# EAGLE design BSK4 (EAGLE 9.4.2)
ESKD_DESCRIPTION1: 207|235|224|242|224|32|193|209|202|52; ESKD_DESCRIPTION2: 241|245|229|236|224|32|253|235|229|234|242|240|232|247|229|241|234|224|255; ESKD_DESCRIPTION3: 239|240|232|237|246|232|239|232|224|235|252|237|224|255; ESKD_NUMBER: 67|67|83|50|46|50|53|48|48|45|48|221|51; ESKD_NUMBER_SHEET: 49; ESKD_SHEETS: 49
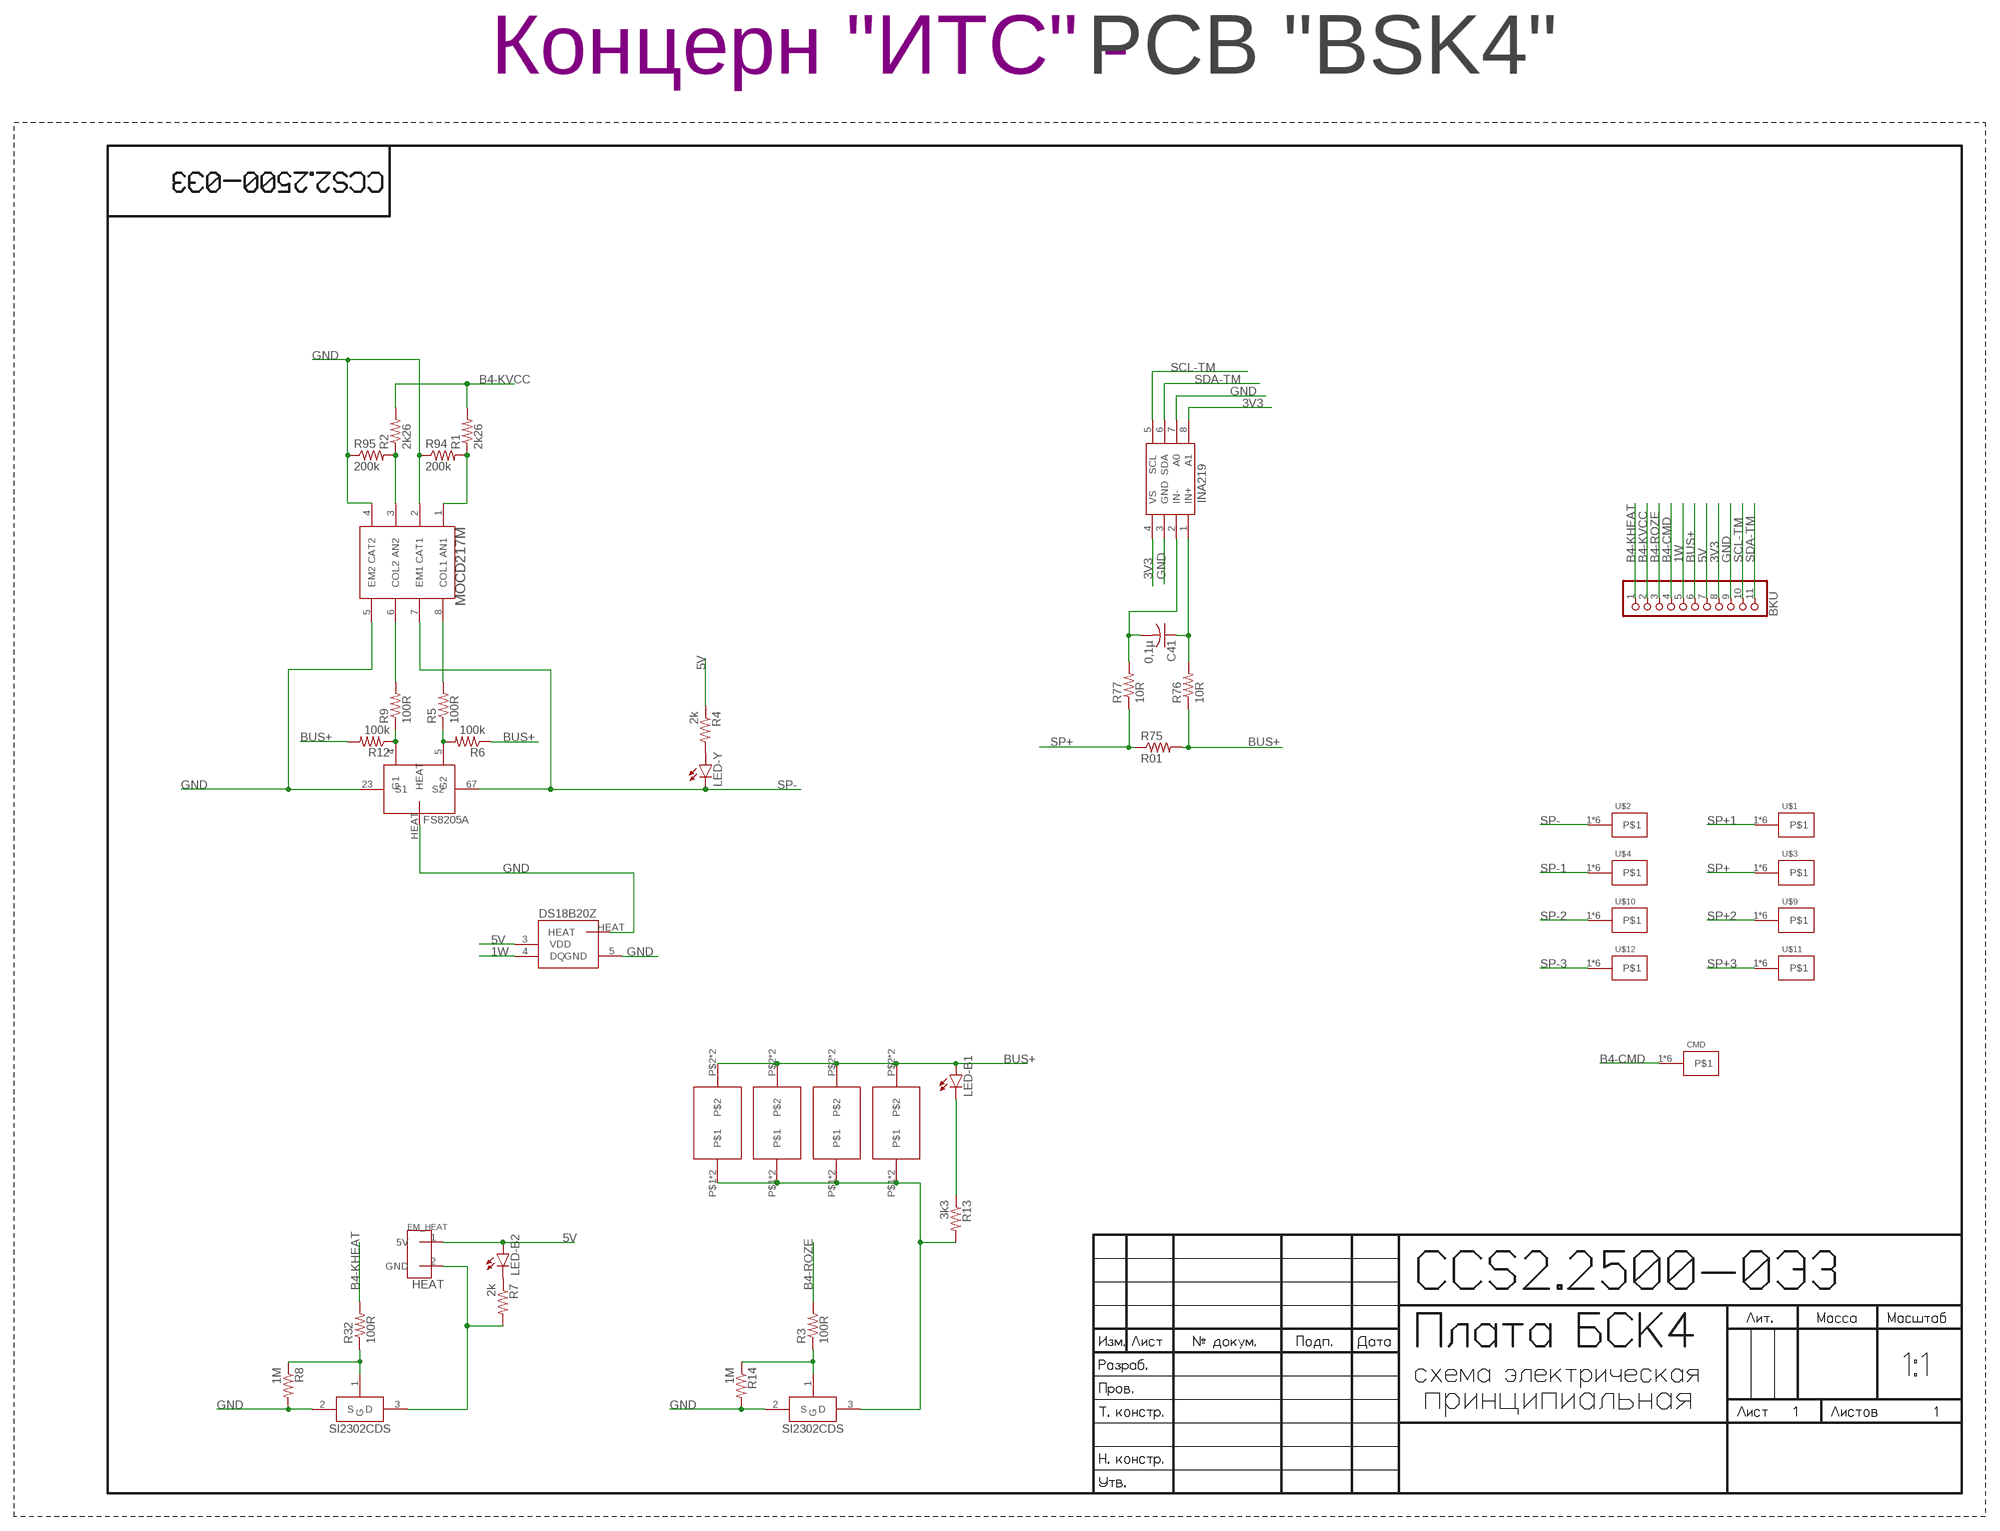
[diagram p0: schematic, sheet 1]

## Parts
BKU  PINHD-1X11  [1X11]
C41  0,1µ  C-USC0603  [C0603]
CMD  KCONNECTQUAD  [KCONNECT_QUAD]
DS18B20Z1  DS18B20Z  [SOIC8+HEAT_S]
INA  INA219AID  [SOT23-8]
LED-B1  LEDCHIPLED_0603  [CHIPLED_0603]
LED-B2  LEDCHIPLED_0603  [CHIPLED_0603]
LED-Y  LAP4-BOTTOM  [P47F-BOTTOM]
R1  2k26  R-US_R0603  [R0603]
R2  2k26  R-US_R0603  [R0603]
R3  100R  R-US_R0603  [R0603]
R4  2k  R-US_R0603  [R0603]
R5  100R  R-US_R0603  [R0603]
R6  100k  R-US_R0603  [R0603]
R7  2k  R-US_R0603  [R0603]
R8  1M  R-US_R0603  [R0603]
R9  100R  R-US_R0603  [R0603]
R12  100k  R-US_R0603  [R0603]
R13  3k3  R-US_R0603  [R0603]
R14  1M  R-US_R0603  [R0603]
R32  100R  R-US_R0603  [R0603]
R75  R01  R-US_R2512  [R2512]
R76  10R  R-US_R0603  [R0603]
R77  10R  R-US_R0603  [R0603]
R94  200k  R-US_R0603  [R0603]
R95  200k  R-US_R0603  [R0603]
U$1  KCONNECT  [KCONNECT]
U$2  KCONNECT  [KCONNECT]
U$3  KCONNECT  [KCONNECT]
U$4  KCONNECT  [KCONNECT]
U$5  MOCD  MOCD217M  [SOIC8]
U$6  GRAFITGRAFIT4_2  [GRAFIT4_2]
U$7  GRAFITGRAFIT4_2  [GRAFIT4_2]
U$8  SI2302CDS  [SOT23-3]
U$9  KCONNECT  [KCONNECT]
U$10  KCONNECT  [KCONNECT]
U$11  KCONNECT  [KCONNECT]
U$12  KCONNECT  [KCONNECT]
U$13  SI2302CDS  [SOT23-3]
U$14  EM_HEAT  [EM_HEAT]
U$15  GRAFITGRAFIT4_2  [GRAFIT4_2]
U$16  GRAFITGRAFIT4_2  [GRAFIT4_2]
U$17  PCB "BSK4"  ITS-LOGOPCB-""  [ITS-LOGO]
U$26  FS8205A+  [FS8205A+]

## Nets
1: R7.2 U$8.3(D) U$14.2(GND)
1W: BKU.5 DS18B20Z1.4(DQ)
2: R13.2 U$6.P$1 U$6.P$4 U$7.P$1 U$7.P$4 U$13.3(D) U$15.P$1 U$15.P$4 U$16.P$1 U$16.P$4
3V3: BKU.8 INA.4(VS) INA.8(A1)
5V: BKU.7 DS18B20Z1.3(VDD) LED-B2.A R4.1 U$14.1(5V)
B4-CMD: BKU.4 CMD.1 CMD.2 CMD.3 CMD.4 CMD.P$1 CMD.P$2
B4-KHEAT: BKU.1 R32.2
B4-KVCC: BKU.2 R1.2 R2.2
B4-ROZE: BKU.3 R3.2
BUS+: BKU.6 LED-B1.A R6.1 R12.2 R75.2 R76.1 U$6.P$2 U$6.P$5 U$7.P$2 U$7.P$5 U$15.P$2 U$15.P$5 U$16.P$2 U$16.P$5
GND: BKU.9 DS18B20Z1.5(GND) DS18B20Z1.HEAT INA.3(GND) INA.7(A0) R8.2 R14.2 R94.1 R95.1 U$5.2(CAT1) U$5.4(CAT2) U$5.5(EM2) U$8.2(S) U$13.2(S) U$26.23(S1) U$26.HEAT
N$17: R1.1 R94.2 U$5.1(AN1)
N$18: R2.1 R95.2 U$5.3(AN2)
N$19: R8.1 R32.1 U$8.1(G)
N$20: R3.1 R14.1 U$13.1(G)
N$26: R5.1 R6.2 U$26.5(G2)
N$27: R9.1 R12.1 U$26.4(G1)
N$28: LED-Y.A R4.2
N$29: LED-B1.C R13.1
N$31: LED-B2.C R7.1
N$150: C41.1 INA.1(IN+) R76.2
N$151: C41.2 INA.2(IN-) R77.2
OC1: R9.2 U$5.6(COL2)
OD1: R5.2 U$5.8(COL1)
SCL-TM: BKU.10 INA.5(SCL)
SDA-TM: BKU.11 INA.6(SDA)
SP+: R75.1 R77.1 U$3.1 U$3.2 U$3.3 U$3.4 U$3.P$1 U$3.P$2
SP+1: U$1.1 U$1.2 U$1.3 U$1.4 U$1.P$1 U$1.P$2
SP+2: U$9.1 U$9.2 U$9.3 U$9.4 U$9.P$1 U$9.P$2
SP+3: U$11.1 U$11.2 U$11.3 U$11.4 U$11.P$1 U$11.P$2
SP-: LED-Y.C U$2.1 U$2.2 U$2.3 U$2.4 U$2.P$1 U$2.P$2 U$5.7(EM1) U$26.67(S2)
SP-1: U$4.1 U$4.2 U$4.3 U$4.4 U$4.P$1 U$4.P$2
SP-2: U$10.1 U$10.2 U$10.3 U$10.4 U$10.P$1 U$10.P$2
SP-3: U$12.1 U$12.2 U$12.3 U$12.4 U$12.P$1 U$12.P$2

## Notes on the sheet
- HEAT

## Library data of the parts
BKU = pinheadCS:PINHD-1X11: PIN HEADER
C41 = rcl:C-US: CAPACITOR, American symbol; SPICEPREFIX: C
CMD U$1-U$4 U$9-U$12 = CanCubeSat:KCONNECT
DS18B20Z1 = CanCubeSat:DS18B20Z
INA = CanCubeSat:INA219AID
LED-B1 LED-B2 = led:LED: LED OSRAM: - CHIPLED LG R971, LG N971, LY N971, LG Q971, LY Q971, LO R971, LY R971 LH N974, LH R974 LS Q976, LO Q976, LY Q976 LO Q996 - Hyper CHIPLED LW Q18S LB Q993, LB Q99A, LB R99A - SideLED LS A670, LO A670, LY A670, LG A670, LP A670 LB A673, LV A673, LT A673, LW A673 LH A674 LY A675 LS A676, LA A676, LO A676, LY A676, LW A676 LS A679, LY A679, LG A679 - Hyper Micro SIDELED® LS Y876, LA Y876, LO Y876, LY Y876 LT Y87S - SmartLED LW L88C, LW L88S LB L89C, LB L89S, LG L890 LS L89K, LO L89K, LY L89K LS L896, LA L896, LO L896, LY L896 - TOPLED LS T670, LO T670, LY T670, LG T670, LP T670 LSG T670, LSP T670, LSY T670, LOP T670, LYG T670 LG T671, LOG T671, LSG T671 LB T673, LV T673, LT T673, LW T673 LH T674 LS T676, LA T676, LO T676, LY T676, LB T676, LH T676, LSB T676, LW T676 LB T67C, LV T67C, LT T67C, LS T67K, LO T67K, LY T67K, LW E67C LS E67B, LA E67B, LO E67B, LY E67B, LB E67C, LV E67C, LT E67C LW T67C LS T679, LY T679, LG T679 LS T770, LO T770, LY T770, LG T770, LP T770 LB T773, LV T773, LT T773, LW T773 LH T774 LS E675, LA E675, LY E675, LS T675 LS T776, LA T776, LO T776, LY T776, LB T776 LHGB T686 LT T68C, LB T68C - Hyper Mini TOPLED® LB M676 - Mini TOPLED Santana® LG M470 LS M47K, LO M47K, LY M47K Source: http://www.osram.convergy.de LUXEON: - LUMILED® LXK2-PW12-R00, LXK2-PW12-S00, LXK2-PW14-U00, LXK2-PW14-V00 LXK2-PM12-R00, LXK2-PM12-S00, LXK2-PM14-U00 LXK2-PE12-Q00, LXK2-PE12-R00, LXK2-PE12-S00, LXK2-PE14-T00, LXK2-PE14-U00 LXK2-PB12-K00, LXK2-PB12-L00, LXK2-PB12-M00, LXK2-PB14-N00, LXK2-PB14-P00, LXK2-PB14-Q00 LXK2-PR12-L00, LXK2-PR12-M00, LXK2-PR14-Q00, LXK2-PR14-R00 LXK2-PD12-Q00, LXK2-PD12-R00, LXK2-PD12-S00 LXK2-PH12-R00, LXK2-PH12-S00 LXK2-PL12-P00, LXK2-PL12-Q00, LXK2-PL12-R00 Source: www.luxeon.com KINGBRIGHT: KA-3528ASYC Source: www.kingbright.com
LED-Y = led:*P4: PointLED® Enhanced Thinfilm LED TOP & BOTTOM mount LS P47F, LR P47F, LA P47F, LY P47F, LT P4SG, LB P4SG, LW P4SG Source: http://catalog.osram-os.com .. LA_LR_LS_LY_P47F_Pb_free.pdf
R1-R9 R12-R14 R32 R76 R77 R94 R95 = resistor:R-US_: RESISTOR, American symbol
R75 = rcl:R-US_: RESISTOR, American symbol; SPICEPREFIX: R
U$5 = CanCubeSat:MOCD217M
U$6 U$7 U$15 U$16 = CanCubeSat:GRAFIT
U$8 U$13 = CanCubeSat:SI2302CDS
U$14 = CanCubeSat:EM_HEAT
U$17 = CanCubeSat:ITS-LOGO
U$26 = CanCubeSat:FS8205A+

## Board
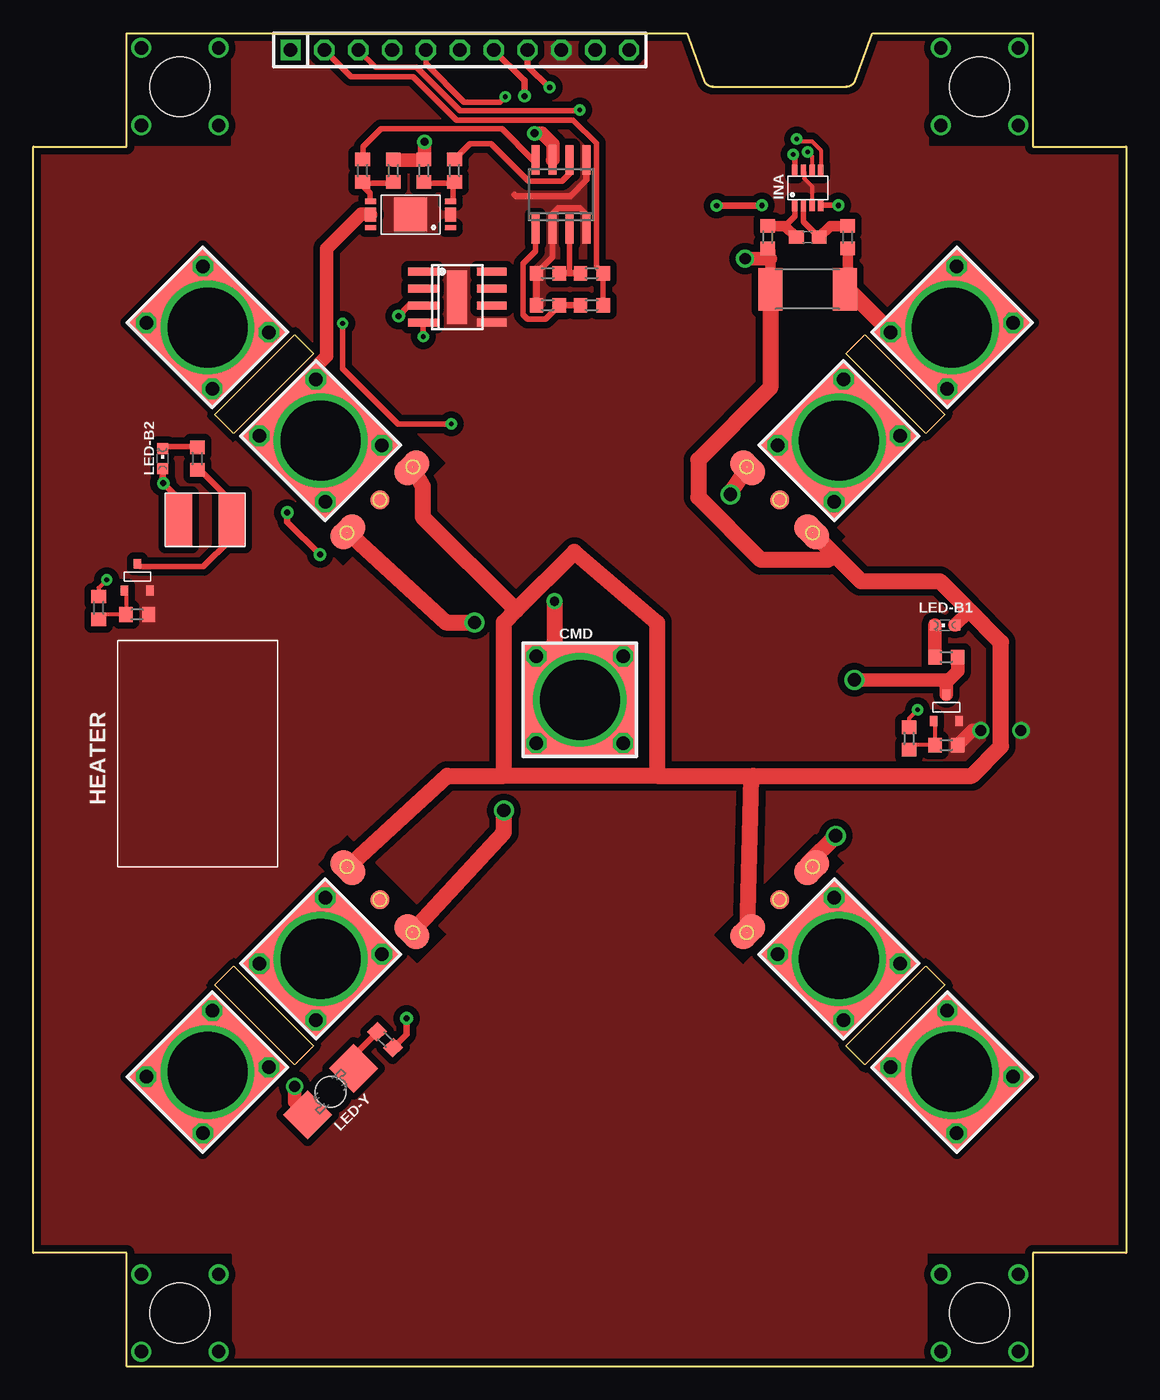
[diagram p1: board, top side]
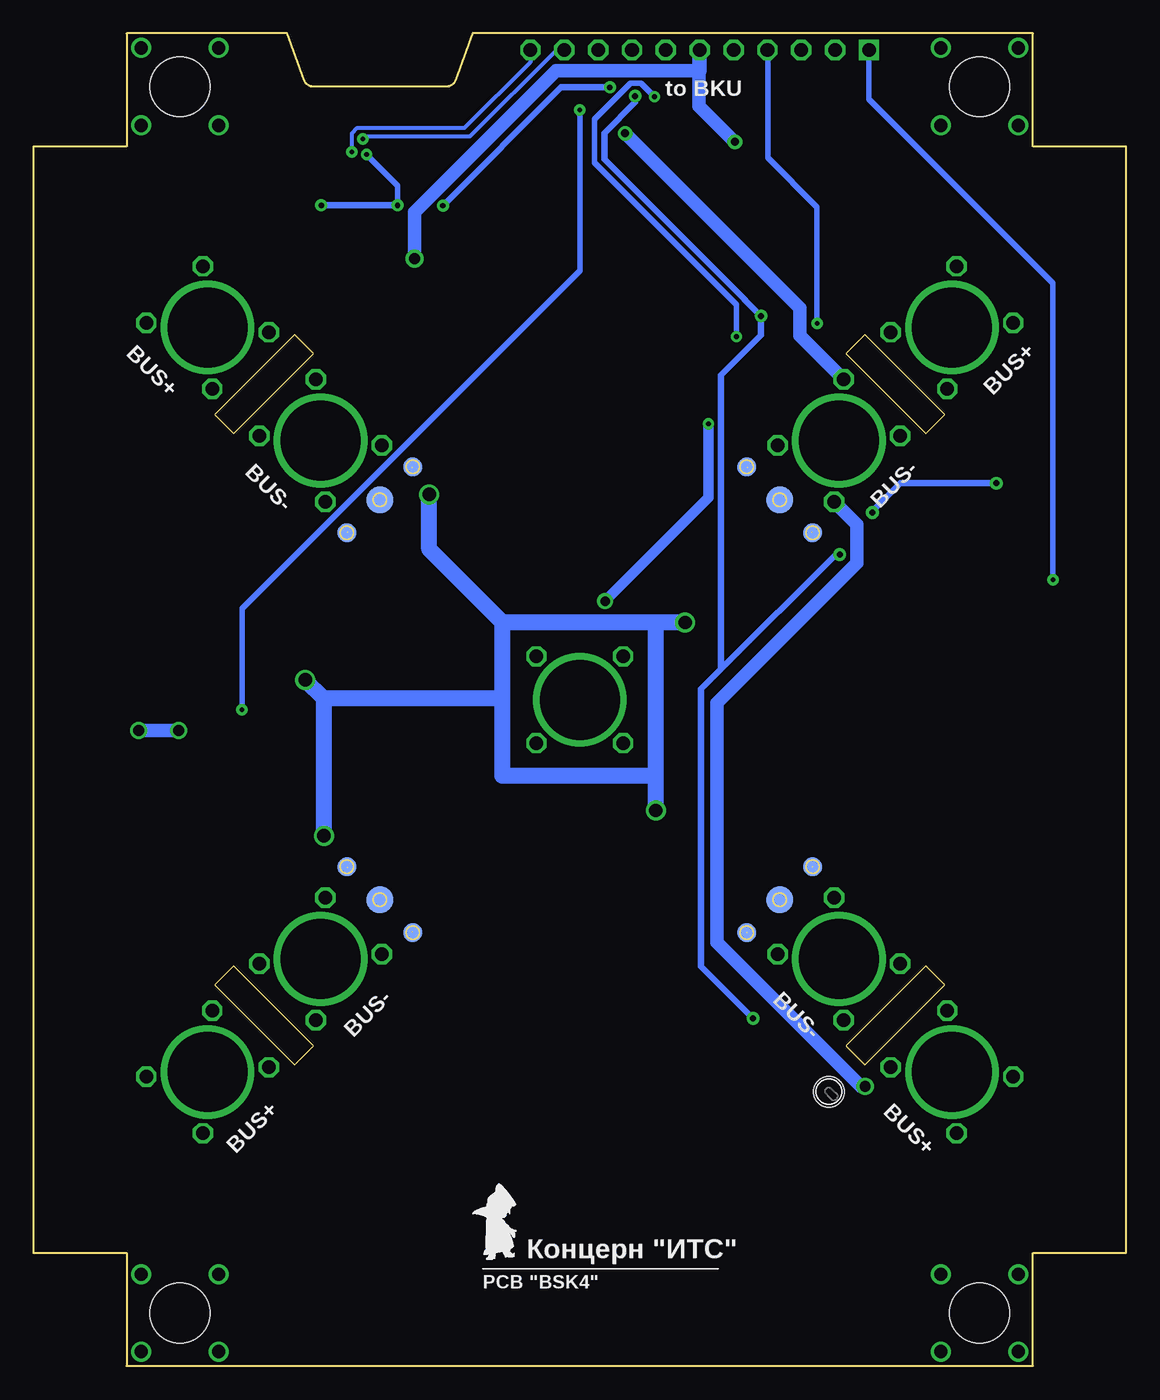
[diagram p2: board, bottom side, seen from below]

Size 82 x 100 mm. Coordinates in mm from the lower left corner, seen from the top.
Outline: 0,8.5 0,91.5 7,91.5 7,100 49.04,100 50.33,96.47 arc70 51,96 61,96 arc70 61.67,96.47 62.96,100 75,100 75,91.5 82,91.5 82,8.5 75,8.5 75,0 7,0 7,8.5 0,8.5
Outline: 60.98,24.01 66.99,30.02 68.4,28.61 62.39,22.6 60.98,24.01
Outline: 13.6,71.39 19.61,77.4 21.02,75.99 15.01,69.98 13.6,71.39
Outline: 66.99,69.98 60.98,75.99 62.39,77.4 68.4,71.39 66.99,69.98
Outline: 19.61,22.6 13.6,28.61 15.01,30.02 21.02,24.01 19.61,22.6
Copper layers (1*16): Top 0.035mm / dielectric 1.5mm / Bottom 0.035mm
Design rules "default *": minimum track width 0.3mm, minimum drill 0.35mm, track to track 0.22mm, track to pad 0.22mm, pad to pad 0.22mm, via to via 0.22mm, smd to smd 0.22mm, copper to edge 0.25mm, drill to drill 8mil, minimum pad ring 0.25mm, minimum via ring 0.25mm, stop-mask expansion 2mil, vias tented up to drill 0mil, thermal gap 10mil
Holes 4.5 mm at 11,4 71,4 71,96 11,96

### Footprints (pad centres in the part's own frame; a part is rotated, then mirrored left to right if it is on the bottom)
1X11 = drill 1.016 square: 1 -12.7,0 | drill 1.016 octagon: 2 -10.16,0; 3 -7.62,0; 4 -5.08,0; 5 -2.54,0; 6 0,0; 7 2.54,0; 8 5.08,0; 9 7.62,0; 10 10.16,0; 11 12.7,0
C0603 = smd 1.1 x 1: 1 -0.85,0; 2 0.85,0
KCONNECT_QUAD = drill 1.016 octagon: 1 -3.25,-3.25; 2 -3.25,3.25; 3 3.25,-3.25; 4 3.25,3.25 | drill 6: P$1 0,0 | smd 8.5 x 8.5: P$2 0,0
SOIC8+HEAT_S = smd 0.6 x 2.2: 1 -1.905,-2.6; 2 -0.635,-2.6; 3 0.635,-2.6; 4 1.905,-2.6; 5 1.905,2.6; 6 0.635,2.6; 7 -0.635,2.6; 8 -1.905,2.6 | smd 4 x 1.5: HEAT 0,0
SOT23-8 = smd 0.9 x 0.4: 1 -1.3,0.975; 2 -1.3,0.325; 3 -1.3,-0.325; 4 -1.3,-0.975; 5 1.3,-0.975; 6 1.3,-0.325; 7 1.3,0.325; 8 1.3,0.975
CHIPLED_0603 = smd 0.8 x 0.8: A 0,-0.75; C 0,0.75
P47F-BOTTOM = smd 2.6 x 2.6: A -2.45,0; C 2.45,0 | hole 2.3: 0,0
R0603 = smd 1 x 1.1: 1 -0.85,0; 2 0.85,0
R2512 = smd 1.8 x 3.2: 1 -2.8,0; 2 2.8,0
KCONNECT = drill 1.016 octagon: 1 -3,-3.5; 2 -3,3.5; 3 3,-3.5; 4 3,3.5 | drill 6: P$1 0,0 | smd 8 x 9: P$2 0,0
SOIC8 = smd 0.6 x 2.2: 1 -1.905,-2.6; 2 -0.635,-2.6; 3 0.635,-2.6; 4 1.905,-2.6; 5 1.905,2.6; 6 0.635,2.6; 7 -0.635,2.6; 8 -1.905,2.6
GRAFIT4_2 = smd 2 x 2 bottom: OUT 0,0 | smd 2 x 2.9: P$1 0,3.4; P$2 0,-3.4 | smd 1.4 x 1.4: P$3 0,0 | smd 1.4 x 1.4 bottom: P$4 0,3.5; P$5 0,-3.5
SOT23-3 = smd 0.56 x 0.73: 1 -0.95,-1; 2 0.95,-1; 3 0,1
EM_HEAT = smd 2 x 4: 1 -2,0; 2 2,0
FS8205A+ = smd 0.4 x 0.8: 1 -0.975,-3; 4 0.975,-3; 5 0.975,3; 8 -0.975,3 | smd 1.05 x 0.8: 23 0,-3; 67 0,3 | smd 2.5 x 2.5: HEAT 0,0

### Placement (x,y rotation side)
BKU  32,98.75 0 top
C41  58.1,84.7 0 top
CMD  41,50 0 top
DS18B20Z1  31.8,80.2 270 top
INA  58.1,88.4 90 top
LED-B1  68.4,55.6 90 top
LED-B2  9.7,68.1 0 top
LED-Y  22.3,20.6 225 top
R1  41.9,79.6 0 top
R2  41.9,82 0 top
R3  65.7,47.1 90 top
R4  26.4,24.5 135 top
R5  24.7,89.7 90 top
R6  27,89.7 270 top
R7  12.3,68.1 270 top
R8  7.8,56.4 0 top
R9  31.6,89.7 90 top
R12  29.3,89.7 90 top
R13  68.5,53.2 0 top
R14  68.5,46.6 0 top
R32  4.9,56.9 90 top
R75  58.1,80.8 180 top
R76  55.1,84.7 90 top
R77  61.1,84.7 90 top
R94  38.6,79.6 0 top
R95  38.6,82 0 top
U$1  13.07,77.93 45 top
U$2  21.55,69.44 45 top
U$3  68.93,77.93 315 top
U$4  60.45,69.44 315 top
U$5  39.6,87.9 0 top
U$6  56,65 45 top
U$7  26,65 135 top
U$8  7.8,59.2 0 top
U$9  13.07,22.07 135 top
U$10  21.55,30.55 135 top
U$11  68.93,22.07 225 top
U$12  60.45,30.55 225 top
U$13  68.5,49.4 0 top
U$14  12.9,63.5 0 top
U$15  56,35 315 top
U$16  26,35 225 top
U$17  48.3,7.3 0 bottom
U$26  28.3,86.4 90 top

### Tracks (layer width: path | path; a pad name or v marks a point on that pad's centre or on a via)
1
  Top 0.4: 14.75,63.5 14.75,62 12.75,60 8,60 U$8.3 | 14.75,63.5 14.75,65 12.5,67.25 R7.2 | 14.75,63.5 U$14.2
1W  (via drill 0.35)
  Top 0.4: v29.25,77.25 29.25,78.25 DS18B20Z1.4 | v35.4,95.25 35,94.85 32.33,94.85 29.46,97.72 BKU.5
  Bottom 0.4: v29.25,77.25 29.25,79.65 39.9,90.3 39.9,93.55 37.2,96.25 36.4,96.25 v35.4,95.25
2  (via drill 1)  (4 unrouted)
  Top 1: R13.2 69.35,52.15 68.7,51.5 | v61.6,51.5 68.7,51.5 | 68.7,51.5 68.5,51.3 U$13.3
  Top 1.2: U$15.P$1 58.12,37.72 v60.2,39.8 | U$16.P$1 35.3,40.06 v35.3,41.7 | U$7.P$1 30.96,55.8 v33.1,55.8 | U$6.P$1 52.3,65.54 v52.3,65.4
  Bottom 1.2: 35.3,44.3 35.3,55.8 | 35.3,44.3 46.8,44.3 46.8,50.1 | 46.8,50.1 46.8,55.8 | v60.2,39.8 60.2,50.1 | 60.2,50.1 v61.6,51.5 | 46.8,50.1 60.2,50.1 | 35.3,55.8 46.8,55.8 | v35.3,41.7 35.3,44.3 | v33.1,55.8 35.3,55.8 | 46.8,55.8 52.3,61.3 v52.3,65.4
3V3  (via drill 0.35, 0.4)
  Top 0.4: INA.4 v60.4,87.1 | INA.8 57.12,90.78 v57,90.9
  Top 0.5: BKU.8 37.08,97.55 38.72,95.92 v38.74,95.94 | v51.27,87.07 54.64,87.07 v54.67,87.1
  Bottom 0.4: v57,90.9 54.67,88.57 v54.67,87.1
  Bottom 0.5: v54.67,87.1 v60.4,87.1 | v38.74,95.94 42.39,95.94 v51.27,87.07
5V  (via drill 0.45)
  Top 0.5: R4.1 28,24.9 v28,26.1 | v21.5,60.9 19.05,63.35 v19.05,64.05 | v27.4,78.8 28.16,79.56 DS18B20Z1.3 | BKU.7 36.79,96.5 36.85,96.47 v36.85,95.3 | LED-B2.A 9.7,66.3 v9.75,66.25 10.9,65.1 U$14.1
  Bottom 0.5: v28,26.1 31.9,30 31.9,50.8 30.4,52.3 | 30.4,52.3 21.8,60.9 v21.5,60.9 | v36.85,95.3 36.85,94.82 39.15,92.52 39.15,90.57 28.6,80.02 28.6,80 v27.4,78.8 27.4,77.35 30.4,74.35 30.4,52.3 | v19.05,64.05 19.05,64.15 16.95,66.25 v9.75,66.25
B4-CMD  (via drill 0.35, 0.7)
  Top 0.4: CMD.P$1 CMD.1 | CMD.P$1 CMD.2 | CMD.P$1 CMD.3 | CMD.P$1 CMD.4 | v31.35,70.7 27.35,70.7 23.2,74.85 v23.2,78.25
  Top 1.2: v39.1,57.4 39.1,54.1 CMD.2
  Bottom 0.4: BKU.4 26.9,98.73 26.9,90.65 23.2,86.95 v23.2,78.25
  Bottom 0.8: v39.1,57.4 31.35,65.15 v31.35,70.7
B4-KHEAT  (via drill 0.35)
  Top 0.3: v5.5,59 4.9,58.4 R32.2
  Bottom 0.4: v5.5,59 5.5,81.25 19.3,95.05 BKU.1
B4-KVCC
  Top 0.4: BKU.2 23.84,96.75 28.5,96.75 31.75,93.5 40.5,93.5 42.25,91.75 42.25,82.5 R2.2 R1.2
B4-ROZE  (via drill 0.35)
  Top 0.3: v66.35,49.25 65.7,48.6 R3.2
  Top 0.4: v41,94.25 40.95,94.2 32,94.2 28.75,97.45 25.68,97.45 BKU.3
  Bottom 0.4: v66.35,49.25 66.35,56.85 41,82.2 v41,94.25
BUS+  (via drill 0.6, 0.85)  (4 unrouted)
  Top 0.4: 27,90.5 R6.1 | R12.2 29.25,90.5
  Top 0.8: R75.2 55.3,83.1 55.3,83.65 R76.1
  Top 1: v29.35,91.86 29.35,90.6 29.25,90.5 27,90.5 | 70.1,56.8 70.1,56.55 LED-B1.A | v53.4,83.1 55.3,83.1
  Top 1.2: 35.3,44.3 35.3,55.8 36.22,56.72 | 46.8,44.3 35.3,44.3 | 46.8,44.3 46.8,55.78 40.59,61.09 36.22,56.72 | 46.8,44.3 54,44.3 | 54,44.3 70.4,44.3 72.6,46.5 72.6,54.3 70.1,56.8 68,58.9 62.1,58.9 60.05,60.95 | U$7.P$2 29.22,66.02 29.22,63.72 36.22,56.72 | U$6.P$2 60.05,60.95 | U$15.P$2 53.88,44.18 54,44.3 | U$16.P$2 31.06,44.3 35.3,44.3 | R75.2 55.3,73.4 49.9,68 49.9,65.2 54.6,60.5 59.6,60.5 60.05,60.95
  Bottom 1: v29.35,91.86 29.38,91.86 32.05,94.52 32.05,98.7 BKU.6 32,97.19 42.8,97.19 53.4,86.59 v53.4,83.1
GND  (via drill 0.8)
  Top 0.3: INA.7 57.85,89.62 57.85,89.1 58.42,88.53 INA.3
  Top 0.4: U$5.2 38.97,83.22 R95.1
  Top 0.5: U$5.5 41.51,89 40.3,87.8 36.2,87.8 36.1,87.9 | U$5.2 38.97,86.47 39.37,86.87 41.03,86.87 41.51,86.39 U$5.4 | R95.1 R94.1
  Top 1: R14.2 70.45,47.7 v71.1,47.7
  Bottom 1: v71.1,47.7 v74.1,47.7
  cutout Top: 13.09,71.3 14.99,69.4 21.59,76 19.69,77.9
  pour Top (isolate 0.5, no thermals): 0,91.5 14.9,91.5 14.9,100 49.1,100 49.1,99.5 49.5,99.1 49.5,98.4 49.8,98.1 49.8,97.5 50.2,97.1 50.2,96.6 50.8,96 61.2,96 61.8,96.6 61.8,97.1 62.1,97.4 62.1,97.9 62.4,98.2 62.4,98.7 62.7,99 62.7,99.5 62.9,99.7 62.9,100 67.1,100 67.1,91.5 82,91.5 82,8.5 67,8.5 67,0 15,0 15,8.4 14.9,8.5 0,8.5
  cutout Top (no thermals): 21.15,62.25 28.75,69.85 30.85,67.75 23.25,60.15
GND1
  cutout Top (no thermals): 58.75,60.15 51.2,67.7 53.3,69.8 60.85,62.25
GND2
  cutout Top (no thermals): 51.15,32.35 58.65,39.85 60.75,37.75 53.25,30.25
GND3
  cutout Top (no thermals): 28.8,30.3 21.45,37.65 23.55,39.75 30.9,32.4
HEAT1
  cutout Top: 60.45,24.07 62.45,22.07 68.95,28.57 66.95,30.57
HEAT2
  cutout Top: 66.93,69.45 68.93,71.45 62.43,77.95 60.43,75.95
HEAT3
  cutout Top: 19.54,22.07 21.54,24.07 15.04,30.57 13.04,28.57
N$1  (via drill 1)
  other vias: 68.1,6.9
N$2  (via drill 1)
  other vias: 68.1,1.1
N$3  (via drill 1)
  other vias: 73.9,1.1
N$4  (via drill 1)
  other vias: 73.9,6.9
N$5  (via drill 1)
  other vias: 8.1,98.9
N$6  (via drill 1)
  other vias: 8.1,93.1
N$7  (via drill 1)
  other vias: 13.9,93.1
N$8  (via drill 1)
  other vias: 13.9,98.9
N$9  (via drill 1)
  other vias: 68.1,98.9
N$10  (via drill 1)
  other vias: 68.1,93.1
N$11  (via drill 1)
  other vias: 8.1,6.9
N$12  (via drill 1)
  other vias: 8.1,1.1
N$13  (via drill 1)
  other vias: 13.9,1.1
N$14  (via drill 1)
  other vias: 13.9,6.9
N$15  (via drill 1)
  other vias: 73.9,93.1
N$16  (via drill 1)
  other vias: 73.9,98.9
N$17
  Top 0.4: U$5.1 37.7,83.66 36.75,82.72 36.75,78.88 37.08,78.55 38.42,78.55 39.45,79.58 R94.2
  Top 0.5: R94.2 R1.1
N$18
  Top 0.4: U$5.3 40.23,82.03 40.2,82
  Top 0.5: R95.2 40.2,82 R2.1
N$19
  Top 0.3: U$8.1 6.95,58.1 R8.1 5.25,56.4 R32.1
N$20
  Top 0.3: U$13.1 67.65,48.3 R14.1 66.05,46.6 R3.1
N$26
  Top 0.4: U$26.5 25.25,87.5 25.25,88 24.5,88.75 R5.1 24.75,88.75 27,88.75 R6.2
N$27
  Top 0.4: 31.5,88.75 31.5,87.5 U$26.4 | 31.5,88.75 29.5,88.75 R12.1 | 31.5,88.75 R9.1
N$28
  Top 0.4: R4.2 25.75,25 24.25,23.5 24.25,22.5 LED-Y.A
N$29
  Top 1: LED-B1.C R13.1
N$31
  Top 0.4: LED-B2.C 9.75,69 12.25,69 R7.1
N$150
  Top 0.4: INA.1 57.12,86.28 56.4,85.55
  Top 0.8: R76.2 56.4,85.55 C41.1
N$151
  Top 0.4: INA.2 57.77,85.88 C41.2
  Top 0.8: R77.2 59.8,85.55 C41.2
OC1
  Top 0.4: R9.2 32.75,91.7 34.35,91.7 37.15,88.9 39.65,88.9 40.25,89.5 40.25,90.5 U$5.6
OD1
  Top 0.4: R5.2 24.75,90.75 24.75,91.5 26.1,92.85 35.15,92.85 37.5,90.5 U$5.8
SCL-TM  (via drill 0.35)
  Top 0.3: v57.26,92.06 57.43,91.89 58.43,91.89 59.08,91.25 INA.5
  Bottom 0.3: BKU.10 42.76,98.75 49.25,92.26 57.06,92.26 v57.26,92.06
SDA-TM  (via drill 0.35)
  Top 0.3: v58.1,91.1 58.42,90.78 INA.6
  Bottom 0.3: v58.1,91.1 58.1,92.5 57.7,92.9 49.65,92.9 44.7,97.85 BKU.11
SP+
  Top 0.4: 69.5,78.75 69.5,78.5 U$3.P$2 | 69.5,78.75 69.5,82.75 U$3.2 | 69.5,78.75 73.75,78.75 U$3.4 | 69.5,78.75 U$3.P$2 | 69.25,78.25 65,78.25 U$3.1 | 69.25,78.25 69.25,74 U$3.3 | 69.25,78.25 U$3.P$2
  Top 0.8: R75.1 61.1,81 R77.1
  Top 1.2: R75.1 61.11,80.8 U$3.1
SP+1
  Top 0.4: 12.25,78.5 12.5,78.5 U$1.P$2 | 12.25,78.5 8.25,78.5 U$1.2 | 12.75,78 12.75,78.25 U$1.P$2 | 12.75,78 12.75,74 U$1.1 | 12.25,78.5 12.25,82.75 U$1.4 | 12.25,78.5 U$1.P$2 | 12.75,78 17,78 U$1.3 | 12.75,78 U$1.P$2
SP+2
  Top 0.4: 12.5,21.25 12.5,21.5 U$9.P$2 | 12.5,21.25 12.5,17.25 U$9.2 | 12.5,21.25 8.25,21.25 U$9.4 | 12.5,21.25 U$9.P$2 | 13,21.75 12.75,21.75 U$9.P$2 | 13,21.75 17,21.75 U$9.1 | 13,21.75 13,26 U$9.3 | 13,21.75 U$9.P$2
SP+3
  Top 0.4: 69.5,21.25 69.5,21.5 U$11.P$2 | 69.5,21.25 69.5,17.25 U$11.4 | 69.25,21.75 65,21.75 U$11.3 | 69.5,21.25 73.75,21.25 U$11.2 | 69.5,21.25 U$11.P$2 | 69.25,21.75 69.25,26 U$11.1 | 69.25,21.75 U$11.P$2
SP-  (via drill 0.6, 0.8)
  Top 0.4: U$2.2 16.5,70.25 21,70.25 U$2.P$2 | 21.5,69.75 21.25,69.75 U$2.P$2 | 21.5,69.75 25.5,69.75 U$2.3 | 21.5,69.75 21.5,69.4 21.5,65.5 U$2.1 | 21.5,69.75 U$2.P$2
  Top 1: U$5.7 38.99,90.53 38.99,91.69 38.19,92.5 v37.6,92.5 | v19.6,21 19.6,19.84 LED-Y.C | U$26.67 25.27,86.42 24.61,86.42 22.02,83.84 22.02,75.77 20.75,74.5 20.75,70.25 U$2.P$2 | U$2.P$2 21.5,69.4 | U$2.P$2 21.2,69.8 U$2.4
  Bottom 1: v37.6,92.5 24.48,79.38 24.48,77.32 U$2.4 | v19.6,21 19.9,21 30.7,31.8 30.7,49.76 20.21,60.25 20.21,63.15 U$2.1
SP-1
  Top 0.4: 60.75,69.5 60.75,69.75 U$4.P$2 | 60.75,69.5 60.75,65.5 U$4.3 | 60.75,69.5 56.5,69.5 U$4.1 | 60.75,69.5 U$4.P$2 | 61.5,74.5 65.5,70.5 U$4.4 | 61.5,74.5 U$4.2 | 61.5,74.5 U$4.P$2
SP-2
  Top 0.4: 20.5,25.5 16.5,29.5 U$10.4 | 20.5,25.5 U$10.2 | 20.5,25.5 U$10.P$2 | 21.25,30.5 21.25,30.25 U$10.P$2 | 21.25,30.5 21.25,34.5 U$10.3 | 21.25,30.5 25.5,30.5 U$10.1 | 21.25,30.5 U$10.P$2
SP-3
  Top 0.4: 60.75,30.25 56.5,30.25 U$12.3 | 65.5,29.5 61.5,25.5 U$12.4 | 65.5,29.5 U$12.2 | 65.5,29.5 U$12.P$2 60.75,30.25 | 60.75,30.25 60.75,34.5 U$12.1

### Text on the board
tPlace: HEATER
bNames: to BKU | BUS+ | BUS+ | BUS- | BUS- | BUS- | BUS- | BUS+ | BUS+